# EAGLE design pandora_B_v1 (EAGLE 9.6.2)

## Sheet 1 of 4: Power
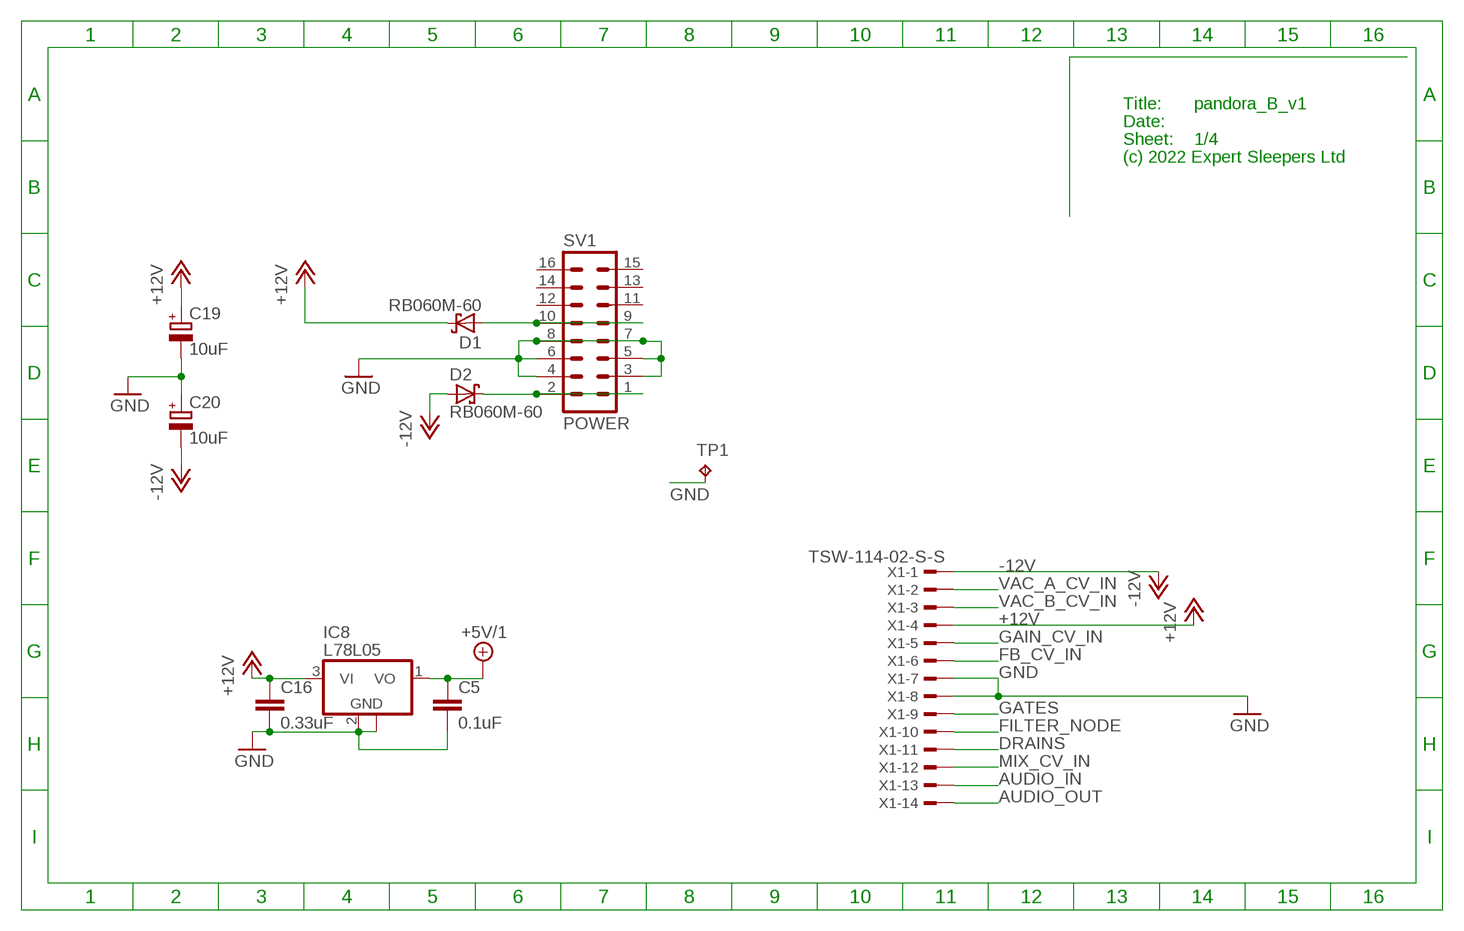
[diagram p0: schematic, sheet 1]

### Parts
C5  0.1uF  C-EUC0402  [C0402]
C16  0.33uF  C-EUC0805  [C0805]
C19  10uF  CPOL-EUUD-4X5,8  [UD-4X5,8_NICHICON]
C20  10uF  CPOL-EUUD-4X5,8  [UD-4X5,8_NICHICON]
D1  RB060M-60  [SOD123FL]
D2  RB060M-60  [SOD123FL]
IC8  L78L05  78L05F  [SOT89]
SV1  POWER  ML16  [ML16]
TP1  RA2  TPPAD1-13  [P1-13]
X1  TSW-114-02-S-S  [TSW-114-02-S-S]

### Nets
+5V/1: C5.1 IC8.1(VO) ; also sheet 2,3,4
+12V: C16.1 C19.+ D1.C IC8.3(VI) X1.4 ; also sheet 2,3,4
-12V: C20.- D2.A X1.1 ; also sheet 2,3,4
AUDIO_IN: X1.13 ; also sheet 2
AUDIO_OUT: X1.14 ; also sheet 2
DRAINS: X1.11 ; also sheet 3
FB_CV_IN: X1.6 ; also sheet 4
FILTER_NODE: X1.10 ; also sheet 3,4
GAIN_CV_IN: X1.5 ; also sheet 4
GATES: X1.9 ; also sheet 3
GND [power]: C5.2 C16.2 C19.- C20.+ IC8.2(GND) IC8.2@1(GND) SV1.3 SV1.4 SV1.5 SV1.6 SV1.7 SV1.8 TP1.TP X1.7 X1.8 ; also sheet 2,3,4
MIX_CV_IN: X1.12 ; also sheet 2
N$1: D2.C SV1.1 SV1.2
N$15: D1.A SV1.9 SV1.10
VAC_A_CV_IN: X1.2 ; also sheet 3
VAC_B_CV_IN: X1.3 ; also sheet 3
Unconnected: SV1.11 SV1.12 SV1.13 SV1.14 SV1.15 SV1.16

### Notes on the sheet
- Title:
- Date:
- Sheet:
- (c) 2022 Expert Sleepers Ltd

## Sheet 2 of 4: Mixer
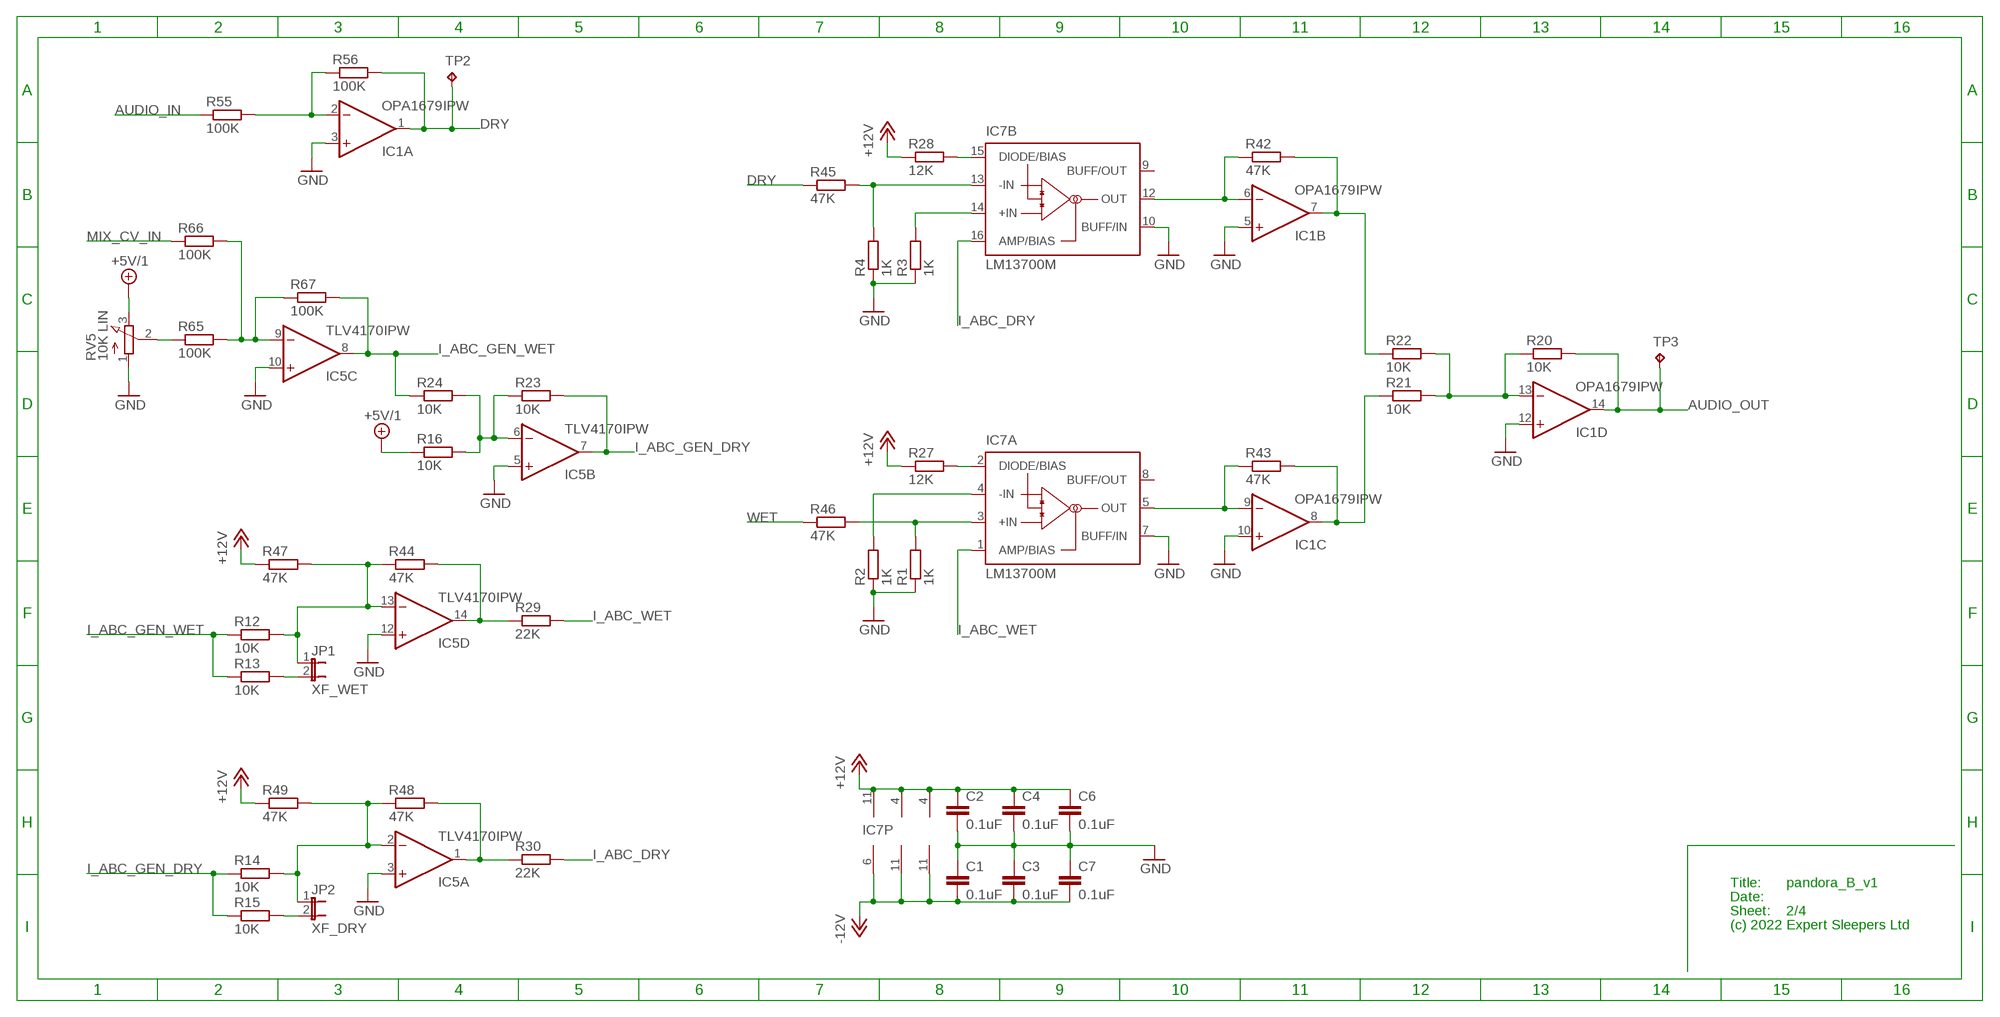
[diagram p1: schematic, sheet 2]

### Parts
C1  0.1uF  C-EUC0402  [C0402]
C2  0.1uF  C-EUC0402  [C0402]
C3  0.1uF  C-EUC0402  [C0402]
C4  0.1uF  C-EUC0402  [C0402]
C6  0.1uF  C-EUC0402  [C0402]
C7  0.1uF  C-EUC0402  [C0402]
IC1  OPA1679IPW  TL074PW  [PW_R-PDSO-G14]
IC5  TLV4170IPW  TL074PW  [PW_R-PDSO-G14]
IC7  LM13700M  [SO16]
JP1  XF_WET  JP1E  [JP1]
JP2  XF_DRY  JP1E  [JP1]
R1  1K  R-EU_R0603  [R0603]
R2  1K  R-EU_R0603  [R0603]
R3  1K  R-EU_R0603  [R0603]
R4  1K  R-EU_R0603  [R0603]
R12  10K  R-EU_R0603  [R0603]
R13  10K  R-EU_R0603  [R0603]
R14  10K  R-EU_R0603  [R0603]
R15  10K  R-EU_R0603  [R0603]
R16  10K  R-EU_R0603  [R0603]
R20  10K  R-EU_R0603  [R0603]
R21  10K  R-EU_R0603  [R0603]
R22  10K  R-EU_R0603  [R0603]
R23  10K  R-EU_R0603  [R0603]
R24  10K  R-EU_R0603  [R0603]
R27  12K  R-EU_R0603  [R0603]
R28  12K  R-EU_R0603  [R0603]
R29  22K  R-EU_R0603  [R0603]
R30  22K  R-EU_R0603  [R0603]
R42  47K  R-EU_R0603  [R0603]
R43  47K  R-EU_R0603  [R0603]
R44  47K  R-EU_R0603  [R0603]
R45  47K  R-EU_R0603  [R0603]
R46  47K  R-EU_R0603  [R0603]
R47  47K  R-EU_R0603  [R0603]
R48  47K  R-EU_R0603  [R0603]
R49  47K  R-EU_R0603  [R0603]
R55  100K  R-EU_R0603  [R0603]
R56  100K  R-EU_R0603  [R0603]
R65  100K  R-EU_R0603  [R0603]
R66  100K  R-EU_R0603  [R0603]
R67  100K  R-EU_R0603  [R0603]
RV5  10K LIN  RD1610NOA0X  [RD1610NOA0X]
TP2  RA2  TPPAD1-13  [P1-13]
TP3  RA2  TPPAD1-13  [P1-13]

### Nets
+5V/1: R16.1 RV5.3(E) ; also sheet 1,3,4
+12V: C2.1 C4.1 C6.1 IC1.4(P:V+) IC5.4(P:V+) IC7.11(P:V+) R27.1 R28.1 R47.1 R49.1 ; also sheet 1,3,4
-12V: C1.2 C3.2 C7.2 IC1.11(P:V-) IC5.11(P:V-) IC7.6(P:V-) ; also sheet 1,3,4
AUDIO_IN: R55.1 ; also sheet 1
AUDIO_OUT: IC1.14(D:OUT) R20.2 TP3.TP ; also sheet 1
DRY: IC1.1(A:OUT) R45.1 R56.2 TP2.TP ; also sheet 4
GND [power]: C1.1 C2.2 C3.1 C4.2 C6.2 C7.1 IC1.3(A:+IN) IC1.5(B:+IN) IC1.10(C:+IN) IC1.12(D:+IN) IC5.3(A:+IN) IC5.5(B:+IN) IC5.10(C:+IN) IC5.12(D:+IN) IC7.7(A:BUFF/IN) IC7.10(B:BUFF/IN) R1.1 R2.1 R3.1 R4.1 RV5.1(A) ; also sheet 1,3,4
I_ABC_DRY: IC7.16(B:AMP/BIAS) R30.2
I_ABC_GEN_DRY: IC5.7(B:OUT) R14.1 R15.1 R23.2
I_ABC_GEN_WET: IC5.8(C:OUT) R12.1 R13.1 R24.1 R67.2
I_ABC_WET: IC7.1(A:AMP/BIAS) R29.2
MIX_CV_IN: R66.1 ; also sheet 1
N$2: IC1.13(D:-IN) R20.1 R21.2 R22.2
N$7: R65.1 RV5.2(S)
N$9: IC7.15(B:DIODE/BIAS) R28.2
N$10: IC1.9(C:-IN) IC7.5(A:OUT) R43.1
N$12: IC7.2(A:DIODE/BIAS) R27.2
N$13: IC1.6(B:-IN) IC7.12(B:OUT) R42.1
N$14: IC1.8(C:OUT) R21.1 R43.2
N$18: IC5.9(C:-IN) R65.2 R66.2 R67.1
N$20: IC1.7(B:OUT) R22.1 R42.2
N$23: IC7.3(A:+IN) R1.2 R46.2
N$24: IC7.4(A:-IN) R2.2
N$26: IC5.13(D:-IN) JP1.1 R12.2 R44.1 R47.2
N$27: IC5.6(B:-IN) R16.2 R23.1 R24.2
N$28: IC5.14(D:OUT) R29.1 R44.2
N$31: IC5.1(A:OUT) R30.1 R48.2
N$32: IC5.2(A:-IN) JP2.1 R14.2 R48.1 R49.2
N$33: IC7.14(B:+IN) R3.2
N$34: IC7.13(B:-IN) R4.2 R45.2
N$44: IC1.2(A:-IN) R55.2 R56.1
N$68: JP2.2 R15.2
N$77: JP1.2 R13.2
WET: R46.1 ; also sheet 3,4
Unconnected: IC7.8(A:BUFF/OUT) IC7.9(B:BUFF/OUT)

### Notes on the sheet
- Title:
- Date:
- Sheet:
- (c) 2022 Expert Sleepers Ltd

## Sheet 3 of 4: Filter core
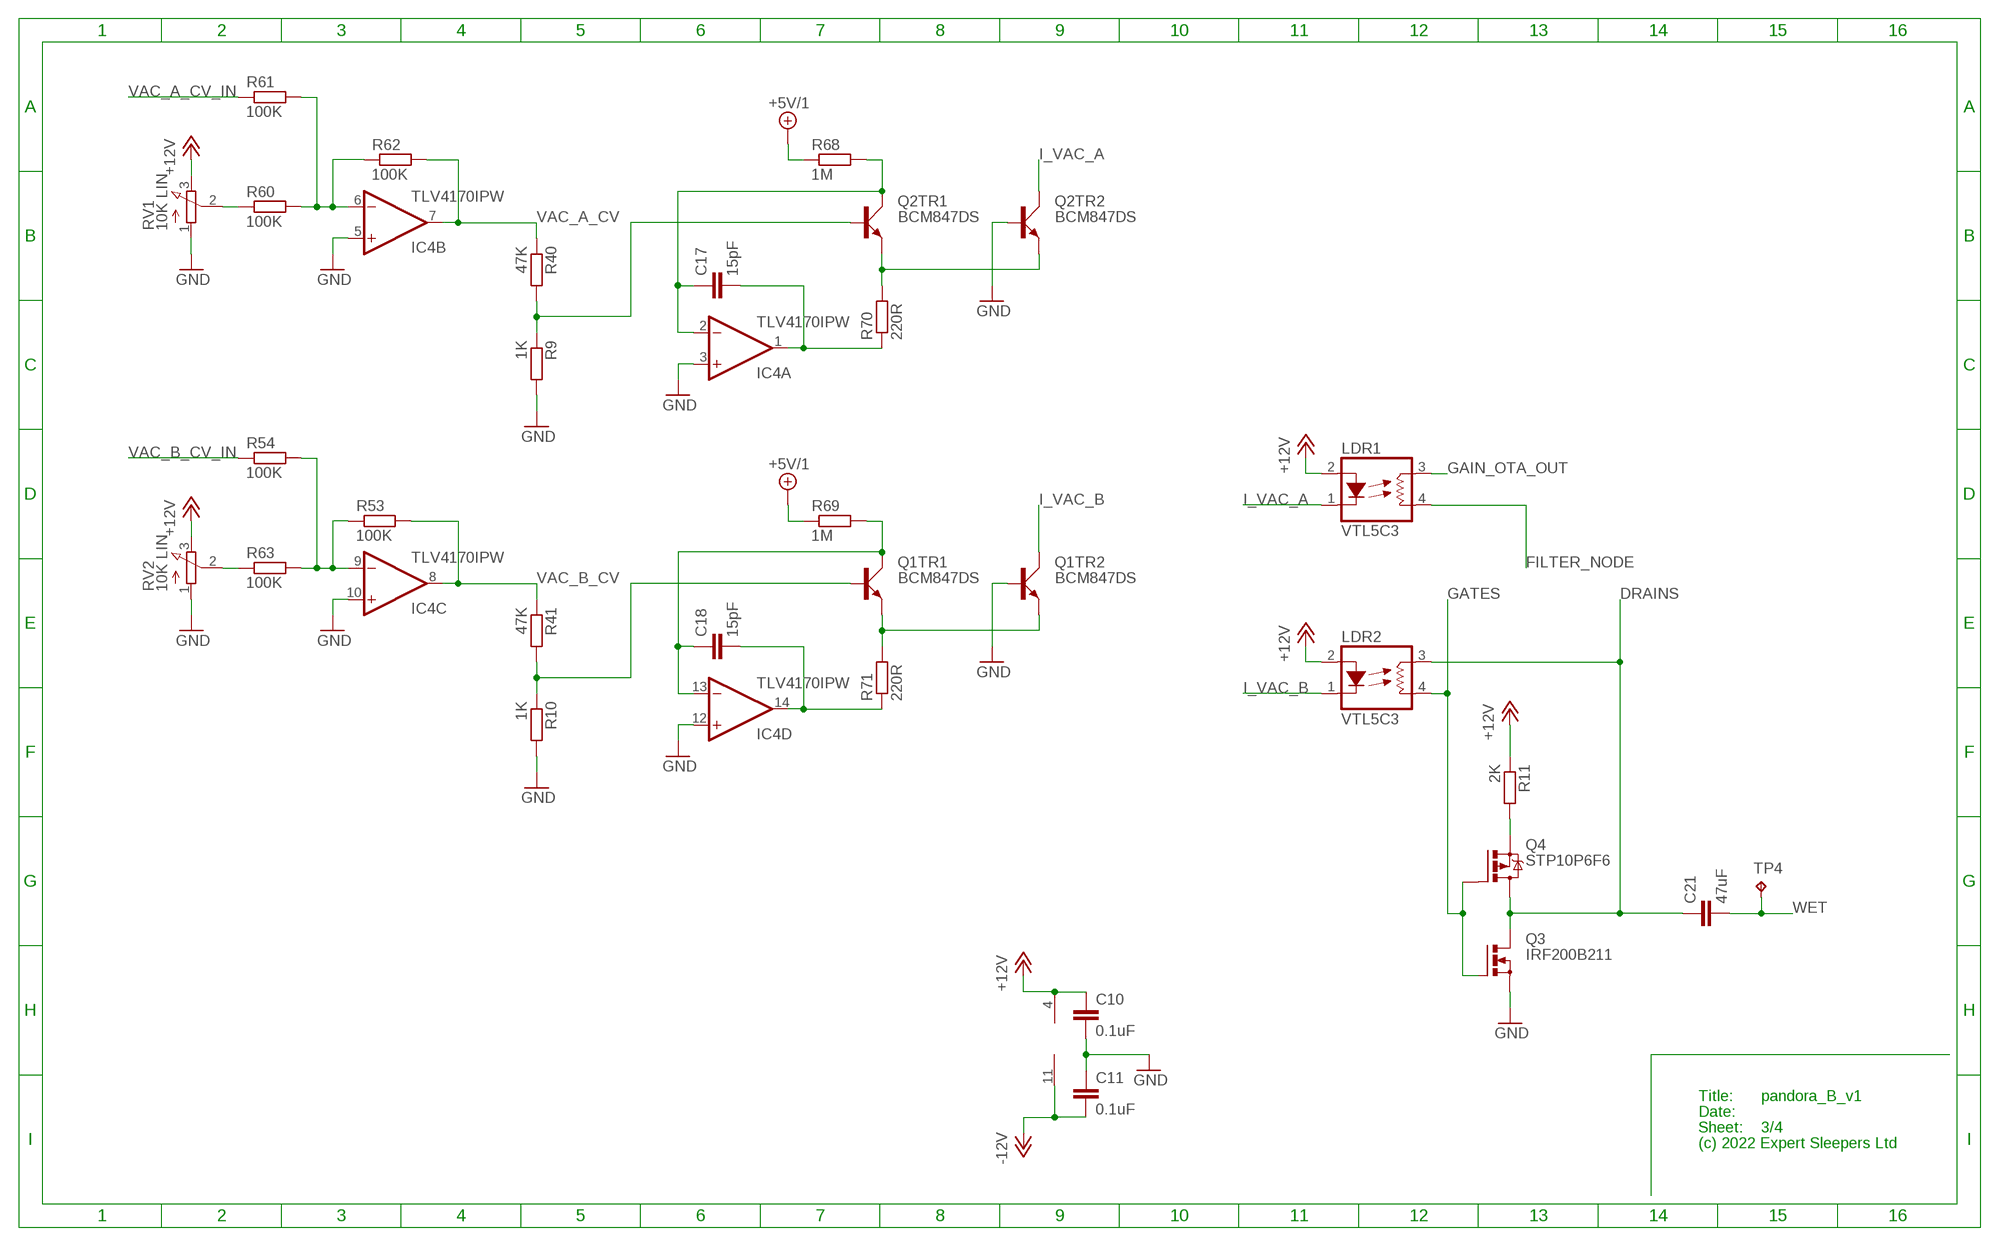
[diagram p2: schematic, sheet 3]

### Parts
C10  0.1uF  C-EUC0402  [C0402]
C11  0.1uF  C-EUC0402  [C0402]
C17  15pF  C-EUC0402  [C0402]
C18  15pF  C-EUC0402  [C0402]
C21  47uF  C-EUC1206  [C1206]
IC4  TLV4170IPW  TL074PW  [PW_R-PDSO-G14]
LDR1  VTL5C3  VTL5C9  [VTL5C]
LDR2  VTL5C3  VTL5C9  [VTL5C]
Q1  BCM847DS  [SOT95P275X110-6N]
Q2  BCM847DS  [SOT95P275X110-6N]
Q3  IRF200B211  IRF512  [TO220BV]
Q4  STP10P6F6  IRF9530  [TO220BV]
R9  1K  R-EU_R0603  [R0603]
R10  1K  R-EU_R0603  [R0603]
R11  2K  R-EU_R1206  [R1206]
R40  47K  R-EU_R0603  [R0603]
R41  47K  R-EU_R0603  [R0603]
R53  100K  R-EU_R0603  [R0603]
R54  100K  R-EU_R0603  [R0603]
R60  100K  R-EU_R0603  [R0603]
R61  100K  R-EU_R0603  [R0603]
R62  100K  R-EU_R0603  [R0603]
R63  100K  R-EU_R0603  [R0603]
R68  1M  R-EU_R0603  [R0603]
R69  1M  R-EU_R0603  [R0603]
R70  220R  R-EU_R0805  [R0805]
R71  220R  R-EU_R0805  [R0805]
RV1  10K LIN  RD1610NOA0X  [RD1610NOA0X]
RV2  10K LIN  RD1610NOA0X  [RD1610NOA0X]
TP4  RA2  TPPAD1-13  [P1-13]

### Nets
+5V/1: R68.1 R69.1 ; also sheet 1,2,4
+12V: C10.1 IC4.4(P:V+) LDR1.2(A) LDR2.2(A) R11.1 RV1.3(E) RV2.3(E) ; also sheet 1,2,4
-12V: C11.2 IC4.11(P:V-) ; also sheet 1,2,4
DRAINS: C21.1 LDR2.3(L1) Q3.D Q4.D ; also sheet 1
FILTER_NODE: LDR1.4(L2) ; also sheet 1,4
GAIN_OTA_OUT: LDR1.3(L1) ; also sheet 4
GATES: LDR2.4(L2) Q3.G Q4.G ; also sheet 1
GND [power]: C10.2 C11.1 IC4.3(A:+IN) IC4.5(B:+IN) IC4.10(C:+IN) IC4.12(D:+IN) Q1.5(TR2:B) Q2.5(TR2:B) Q3.S R9.2 R10.2 RV1.1(A) RV2.1(A) ; also sheet 1,2,4
I_VAC_A: LDR1.1(C) Q2.3(TR2:C)
I_VAC_B: LDR2.1(C) Q1.3(TR2:C)
N$49: R60.1 RV1.2(S)
N$56: IC4.6(B:-IN) R60.2 R61.2 R62.1
N$57: R63.1 RV2.2(S)
N$58: IC4.9(C:-IN) R53.1 R54.2 R63.2
N$59: Q2.2(TR1:B) R9.1 R40.2
N$60: C17.1 IC4.2(A:-IN) Q2.6(TR1:C) R68.2
N$61: C17.2 IC4.1(A:OUT) R70.1
N$64: Q2.1(TR1:E) Q2.4(TR2:E) R70.2
N$67: Q1.2(TR1:B) R10.1 R41.2
N$69: C18.1 IC4.13(D:-IN) Q1.6(TR1:C) R69.2
N$70: C18.2 IC4.14(D:OUT) R71.1
N$73: Q1.1(TR1:E) Q1.4(TR2:E) R71.2
N$75: Q4.S R11.2
VAC_A_CV: IC4.7(B:OUT) R40.1 R62.2
VAC_A_CV_IN: R61.1 ; also sheet 1
VAC_B_CV: IC4.8(C:OUT) R41.1 R53.2
VAC_B_CV_IN: R54.1 ; also sheet 1
WET: C21.2 TP4.TP ; also sheet 2,4

### Notes on the sheet
- Title:
- Date:
- Sheet:
- (c) 2022 Expert Sleepers Ltd

## Sheet 4 of 4: Gain and Feedback
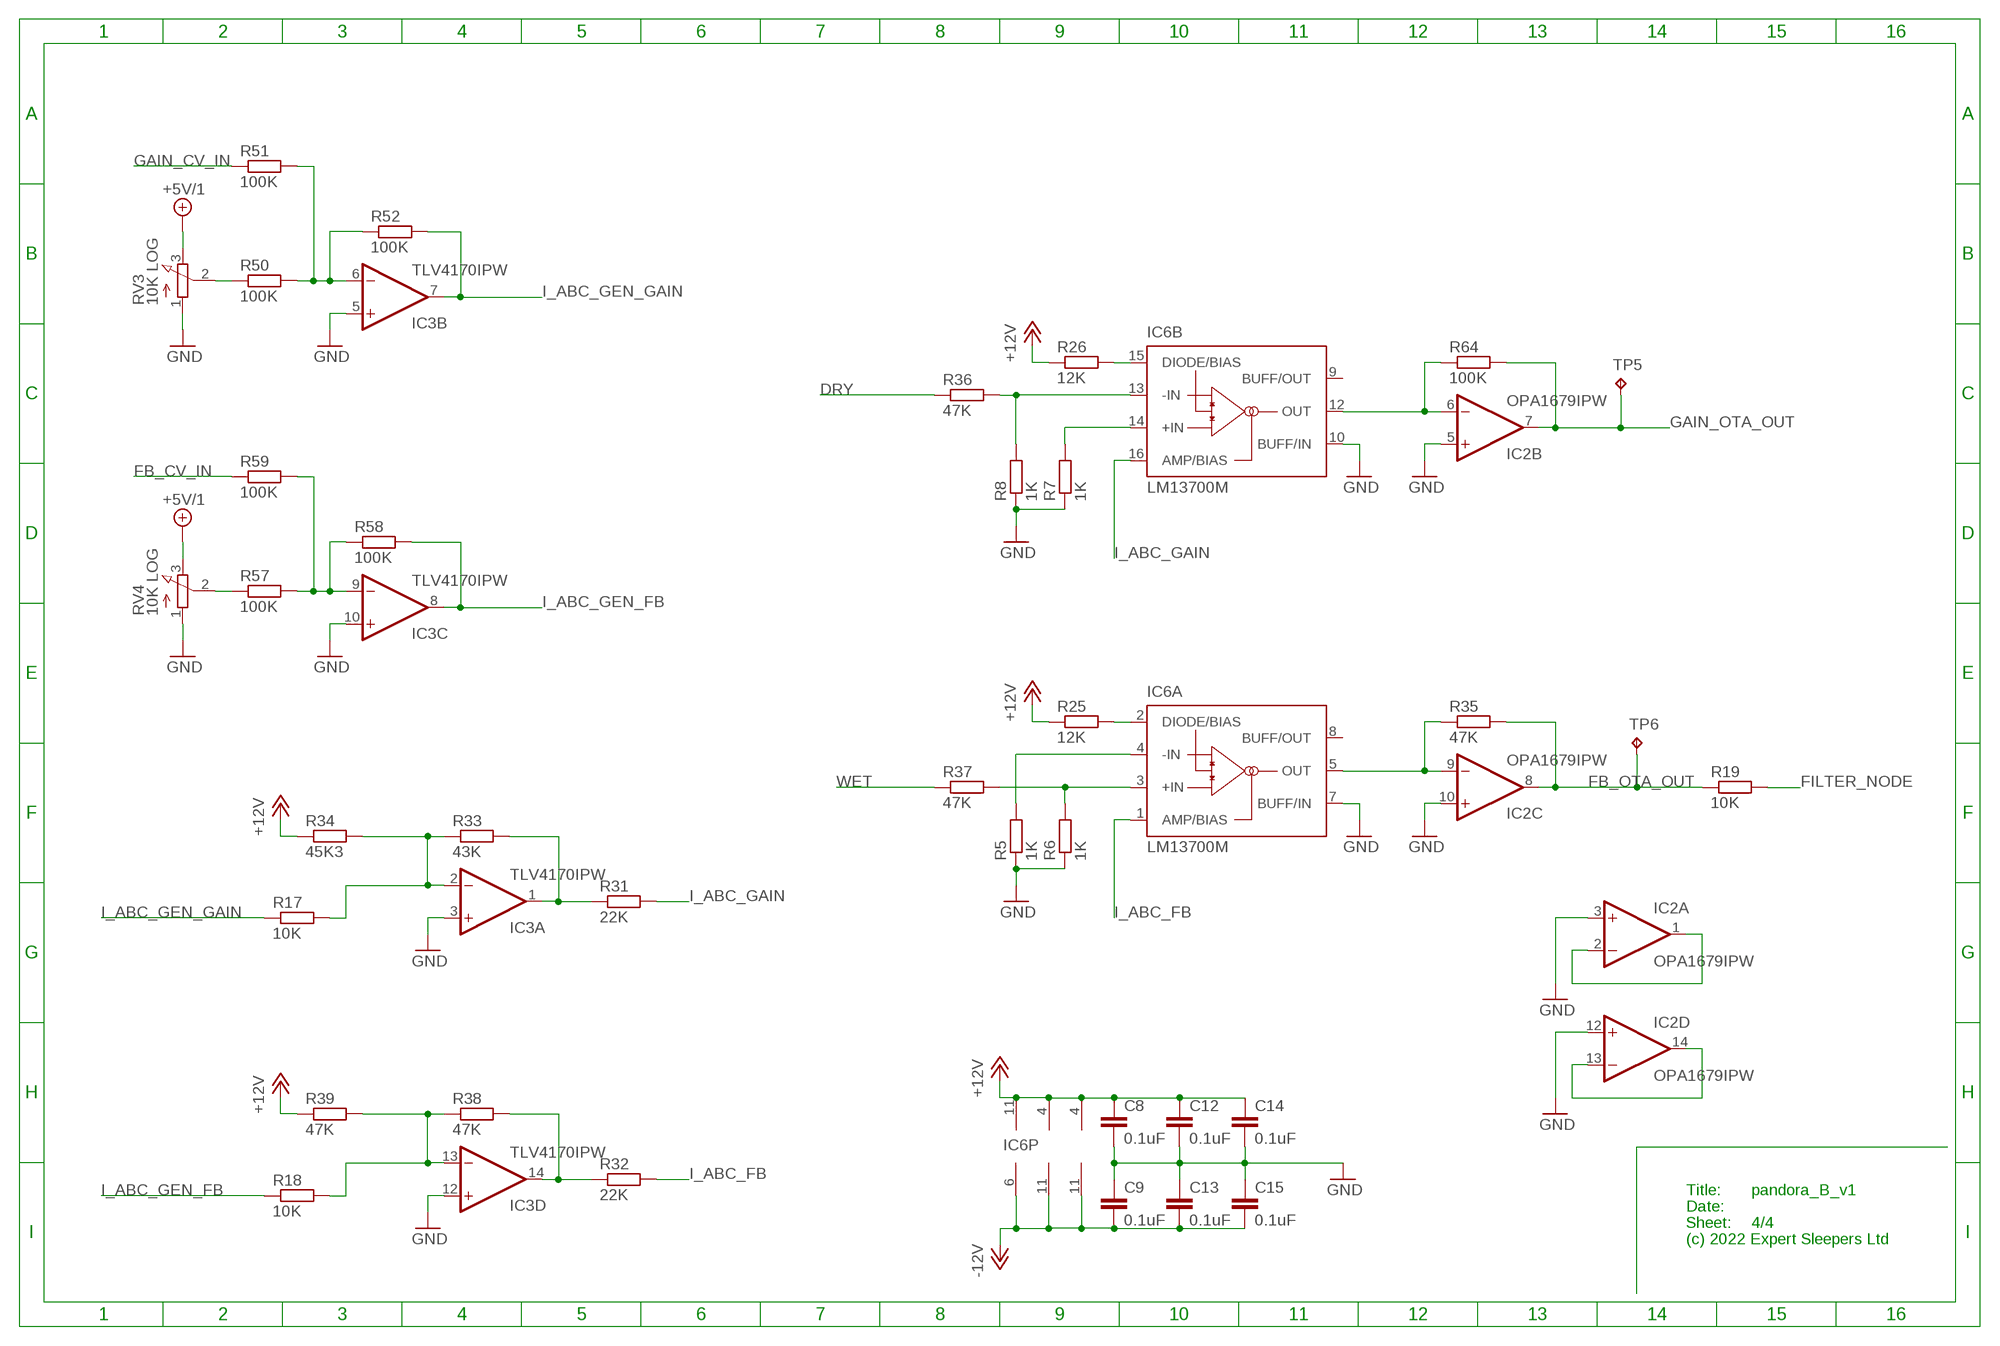
[diagram p3: schematic, sheet 4]

### Parts
C8  0.1uF  C-EUC0402  [C0402]
C9  0.1uF  C-EUC0402  [C0402]
C12  0.1uF  C-EUC0402  [C0402]
C13  0.1uF  C-EUC0402  [C0402]
C14  0.1uF  C-EUC0402  [C0402]
C15  0.1uF  C-EUC0402  [C0402]
IC2  OPA1679IPW  TL074PW  [PW_R-PDSO-G14]
IC3  TLV4170IPW  TL074PW  [PW_R-PDSO-G14]
IC6  LM13700M  [SO16]
R5  1K  R-EU_R0603  [R0603]
R6  1K  R-EU_R0603  [R0603]
R7  1K  R-EU_R0603  [R0603]
R8  1K  R-EU_R0603  [R0603]
R17  10K  R-EU_R0603  [R0603]
R18  10K  R-EU_R0603  [R0603]
R19  10K  R-EU_R0603  [R0603]
R25  12K  R-EU_R0603  [R0603]
R26  12K  R-EU_R0603  [R0603]
R31  22K  R-EU_R0603  [R0603]
R32  22K  R-EU_R0603  [R0603]
R33  43K  R-EU_R0603  [R0603]
R34  45K3  R-EU_R0603  [R0603]
R35  47K  R-EU_R0603  [R0603]
R36  47K  R-EU_R0603  [R0603]
R37  47K  R-EU_R0603  [R0603]
R38  47K  R-EU_R0603  [R0603]
R39  47K  R-EU_R0603  [R0603]
R50  100K  R-EU_R0603  [R0603]
R51  100K  R-EU_R0603  [R0603]
R52  100K  R-EU_R0603  [R0603]
R57  100K  R-EU_R0603  [R0603]
R58  100K  R-EU_R0603  [R0603]
R59  100K  R-EU_R0603  [R0603]
R64  100K  R-EU_R0603  [R0603]
RV3  10K LOG  RD1610NOA0X  [RD1610NOA0X]
RV4  10K LOG  RD1610NOA0X  [RD1610NOA0X]
TP5  RA2  TPPAD1-13  [P1-13]
TP6  RA2  TPPAD1-13  [P1-13]

### Nets
+5V/1: RV3.3(E) RV4.3(E) ; also sheet 1,2,3
+12V: C8.1 C12.1 C14.1 IC2.4(P:V+) IC3.4(P:V+) IC6.11(P:V+) R25.1 R26.1 R34.1 R39.1 ; also sheet 1,2,3
-12V: C9.2 C13.2 C15.2 IC2.11(P:V-) IC3.11(P:V-) IC6.6(P:V-) ; also sheet 1,2,3
DRY: R36.1 ; also sheet 2
FB_CV_IN: R59.1 ; also sheet 1
FB_OTA_OUT: IC2.8(C:OUT) R19.1 R35.2 TP6.TP
FILTER_NODE: R19.2 ; also sheet 1,3
GAIN_CV_IN: R51.1 ; also sheet 1
GAIN_OTA_OUT: IC2.7(B:OUT) R64.2 TP5.TP ; also sheet 3
GND [power]: C8.2 C9.1 C12.2 C13.1 C14.2 C15.1 IC2.3(A:+IN) IC2.5(B:+IN) IC2.10(C:+IN) IC2.12(D:+IN) IC3.3(A:+IN) IC3.5(B:+IN) IC3.10(C:+IN) IC3.12(D:+IN) IC6.7(A:BUFF/IN) IC6.10(B:BUFF/IN) R5.1 R6.1 R7.1 R8.1 RV3.1(A) RV4.1(A) ; also sheet 1,2,3
I_ABC_FB: IC6.1(A:AMP/BIAS) R32.2
I_ABC_GAIN: IC6.16(B:AMP/BIAS) R31.2
I_ABC_GEN_FB: IC3.8(C:OUT) R18.1 R58.2
I_ABC_GEN_GAIN: IC3.7(B:OUT) R17.1 R52.2
N$35: R57.1 RV4.2(S)
N$36: IC3.9(C:-IN) R57.2 R58.1 R59.2
N$37: IC6.15(B:DIODE/BIAS) R26.2
N$38: IC6.2(A:DIODE/BIAS) R25.2
N$39: IC2.9(C:-IN) IC6.5(A:OUT) R35.1
N$40: IC2.6(B:-IN) IC6.12(B:OUT) R64.1
N$41: IC2.1(A:OUT) IC2.2(A:-IN)
N$42: IC2.13(D:-IN) IC2.14(D:OUT)
N$43: IC6.3(A:+IN) R6.2 R37.2
N$45: IC6.4(A:-IN) R5.2
N$46: IC6.14(B:+IN) R7.2
N$48: IC6.13(B:-IN) R8.2 R36.2
N$50: R50.1 RV3.2(S)
N$51: IC3.6(B:-IN) R50.2 R51.2 R52.1
N$52: IC3.2(A:-IN) R17.2 R33.1 R34.2
N$53: IC3.1(A:OUT) R31.1 R33.2
N$54: IC3.14(D:OUT) R32.1 R38.2
N$55: IC3.13(D:-IN) R18.2 R38.1 R39.2
WET: R37.1 ; also sheet 2,3
Unconnected: IC6.8(A:BUFF/OUT) IC6.9(B:BUFF/OUT)

### Notes on the sheet
- Title:
- Date:
- Sheet:
- (c) 2022 Expert Sleepers Ltd

## Library data of the parts
C1-C18 C21 = rcl:C-EU: CAPACITOR, European symbol
C19 C20 = rcl:CPOL-EU: POLARIZED CAPACITOR, European symbol
D1 D2 = rohm2:RB060M-60: Schottky Barrier Diode
IC1-IC5 = digital-audio:TL074: OP AMP
IC6 IC7 = texas:LM13700: Dual Operational Transconductance Amplifiers with Linearizing Diodes and Buffers Source: lm13700.PDF
IC8 = linear:78L*: POSITOIV-VOLTAGE REGULATORS Output up to 100 mA Source: http://focus.ti.com/lit/ds/symlink/ua78l05.pdf
JP1 JP2 = jumper:JP1E: JUMPER
LDR1 LDR2 = optocoupler:VTL5C*: Low Cost Axial Vactrols Source: www.perkinelmer.com/opto ... vtl5c9_c10.pdf; MF: VACTEC PHOTO; MPN: VTL5C9; OC_FARNELL: 2067857; OC_NEWARK: 95F9033
Q1 Q2 = SamacSys_Parts:BCM847DS: Bipolar Transistors - BJT TRANS MATCHED PAIR Source: Datasheet <https://assets.nexperia.com/documents/data-sheet/BCM847BV_BS_DS.pdf>; ARROW_PART_NUMBER: BCM847DS,135; ARROW_PRICE-STOCK: https://www.arrow.com/en/products/bcm847ds135/nexperia; DESCRIPTION: Bipolar Transistors - BJT TRANS MATCHED PAIR; HEIGHT: 1.1mm; MANUFACTURER_NAME: Nexperia; MANUFACTURER_PART_NUMBER: BCM847DS,135; MOUSER_PART_NUMBER: 771-BCM847DS135; MOUSER_PRICE-STOCK: https://www.mouser.co.uk/ProductDetail/Nexperia/BCM847DS135?qs=me8TqzrmIYUAGZzjtP%252B2bg%3D%3D
Q3 = transistor-power:IRF512: N-CHANNEL MOS FET
Q4 = transistor-power:IRF9530: P-CHANNEL HEXFET POWER-MOS-FET Source: http://www.irf.com/product-info/datasheets/data/irf9530.pdf
R1-R71 = rcl:R-EU_: RESISTOR, European symbol
RV1-RV5 = soundwell:RD1610NOA0X: 16mm Potentiometer one level Source: http://www.alphapotentiometers.net/html/16mm_pot_2.html
SV1 = digital-audio:ML16: MULTICOMP - MC9A12-1634
TP1-TP6 = testpad:TP: Test pad
X1 = con-samtec:TSW-114-02-S-S: THROUGH-HOLE .025" SQ POST HEADER Source: Samtec TSW.pdf; OC_FARNELL: unknown; OC_NEWARK: unknown

## Board
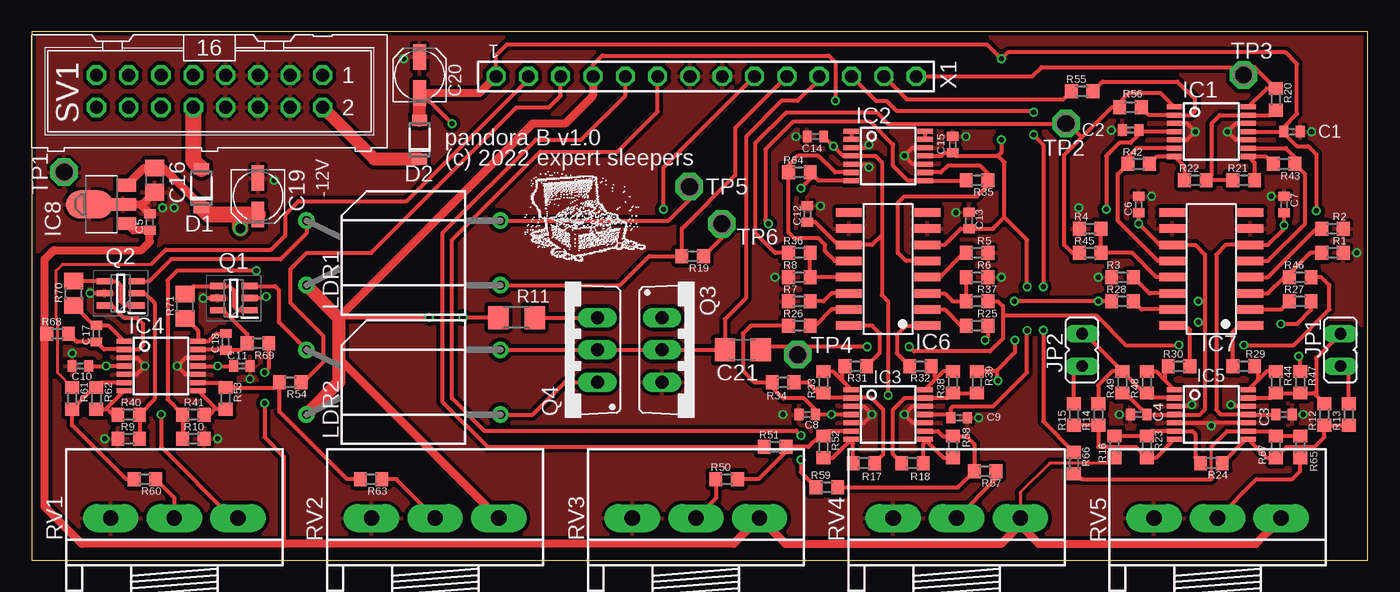
[diagram p4: board, top side]
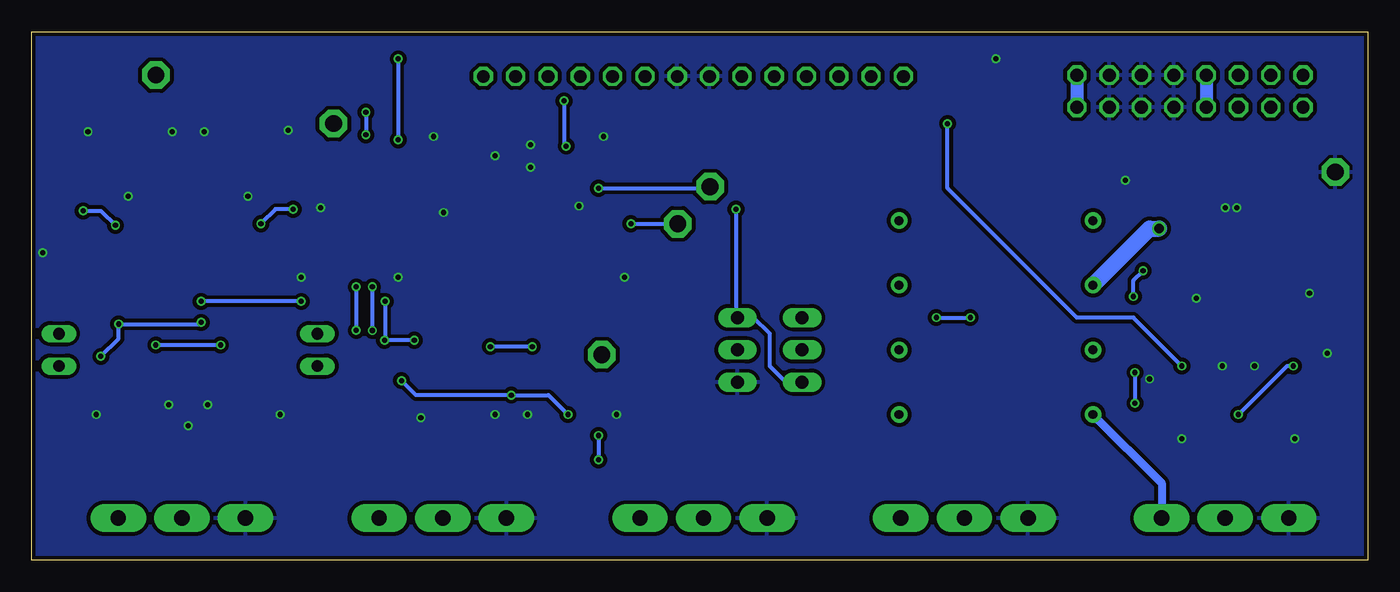
[diagram p5: board, bottom side, seen from below]

Size 105 x 41.5 mm. Coordinates in mm from the lower left corner, seen from the top.
Outline: 0,0 105,0 105,41.5 0,41.5 0,0
Copper layers (1*16): Top 0.035mm / dielectric 1.5mm / Bottom 0.035mm
Design rules "pcbtrain *": minimum track width 0.125mm, minimum drill 0.3mm, track to track 0.125mm, track to pad 0.125mm, pad to pad 0.125mm, via to via 0.125mm, smd to smd 0.125mm, copper to edge 0.25mm, drill to drill 8mil, minimum pad ring 0.15mm, minimum via ring 0.15mm, stop-mask expansion 4mil, vias tented up to drill 0mil, thermal gap 10mil

### Footprints (pad centres in the part's own frame; a part is rotated, then mirrored left to right if it is on the bottom)
C0402 = smd 0.7 x 0.9: 1 -0.65,0; 2 0.65,0
C0805 = smd 1.3 x 1.5: 1 -0.95,0; 2 0.95,0
UD-4X5,8_NICHICON = smd 2 x 1: + 1.425,0; - -1.425,0
C1206 = smd 1.6 x 1.8: 1 -1.4,0; 2 1.4,0
SOD123FL = smd 0.85 x 1.2: A 1.525,0; C -1.525,0
PW_R-PDSO-G14 = smd 0.4 x 1.2: 1 -1.95,-2.9; 2 -1.3,-2.9; 3 -0.65,-2.9; 4 0,-2.9; 5 0.65,-2.9; 6 1.3,-2.9; 7 1.95,-2.9; 8 1.95,2.9; 9 1.3,2.9; 10 0.65,2.9; 11 0,2.9; 12 -0.65,2.9; 13 -1.3,2.9; 14 -1.95,2.9
SO16 = smd 0.66 x 2.032: 1 -4.445,-3.073; 2 -3.175,-3.073; 3 -1.905,-3.073; 4 -0.635,-3.073; 5 0.635,-3.073; 6 1.905,-3.073; 7 3.175,-3.073; 8 4.445,-3.073; 9 4.445,3.073; 10 3.175,3.073; 11 1.905,3.073; 12 0.635,3.073; 13 -0.635,3.073; 14 -1.905,3.073; 15 -3.175,3.073; 16 -4.445,3.073
SOT89 = smd 1 x 1.5: 1 -1.499,-1.981; 3 1.499,-1.981 | smd 1 x 2: 2 0,-1.727 | smd 2.2 x 3.7: 2@1 0,0.94
JP1 = drill 0.914 long: 1 0,-1.27; 2 0,1.27
VTL5C = drill 0.7 pad 1.3: 1 -7.62,2.54; 2 -7.62,-2.54; 3 7.62,2.54; 4 7.62,-2.54
SOT95P275X110-6N = smd 1.25 x 0.5: 1 -1.25,0.95; 2 -1.25,0; 3 -1.25,-0.95; 4 1.25,-0.95; 5 1.25,0; 6 1.25,0.95
TO220BV = drill 1.016 long: D 0,-2.54; G -2.54,-2.54; S 2.54,-2.54
R0603 = smd 1 x 1.1: 1 -0.85,0; 2 0.85,0
R1206 = smd 1.6 x 1.803: 1 -1.422,0; 2 1.422,0
R0805 = smd 1.3 x 1.5: 1 -0.95,0; 2 0.95,0
RD1610NOA0X = drill 1.2 pad 2.184 long: 1 -5,3.8; 2 0,3.8; 3 5,3.8
ML16 = drill 1.016 octagon: 1 -8.89,-1.27; 2 -8.89,1.27; 3 -6.35,-1.27; 4 -6.35,1.27; 5 -3.81,-1.27; 6 -3.81,1.27; 7 -1.27,-1.27; 8 -1.27,1.27; 9 1.27,-1.27; 10 1.27,1.27; 11 3.81,-1.27; 12 3.81,1.27; 13 6.35,-1.27; 14 6.35,1.27; 15 8.89,-1.27; 16 8.89,1.27
P1-13 = drill 1.321 pad 2.159 octagon: TP 0,0
TSW-114-02-S-S = drill 1 pad 1.5 octagon: 1 16.51,0; 2 13.97,0; 3 11.43,0; 4 8.89,0; 5 6.35,0; 6 3.81,0; 7 1.27,0; 8 -1.27,0; 9 -3.81,0; 10 -6.35,0; 11 -8.89,0; 12 -11.43,0; 13 -13.97,0; 14 -16.51,0

### Placement (x,y rotation side)
C1  99.06,33.66 180 top
C2  86.36,33.78 180 top
C3  98.42,11.43 180 top
C4  87,11.43 180 top
C5  9.27,26.54 90 top
C6  87,27.94 90 top
C7  98.42,27.94 270 top
C8  60.96,11.43 180 top
C9  72.9,11.18 180 top
C10  3.81,15.24 180 top
C11  16.51,15.24 180 top
C12  60.96,27.18 90 top
C13  73.66,26.67 270 top
C14  61.59,33.27 180 top
C15  72.39,32.64 270 top
C16  9.65,29.84 270 top
C17  5.08,17.78 90 top
C18  15.24,17.14 90 top
C19  17.78,28.57 270 top
C20  30.48,38.1 90 top
C21  55.88,16.51 0 top
D1  13.34,29.21 90 top
D2  30.48,33.02 90 top
IC1  92.71,33.66 270 top
IC2  67.31,31.75 270 top
IC3  67.31,11.43 270 top
IC4  10.16,15.24 270 top
IC5  92.71,11.43 270 top
IC6  67.31,22.86 90 top
IC7  92.71,22.86 90 top
IC8  5.46,27.94 90 top
JP1  102.87,16.51 180 top
JP2  82.55,16.51 180 top
LDR1  29.21,24.13 0 top
LDR2  29.21,13.97 0 top
Q1  15.88,20.57 180 top
Q2  6.99,20.95 180 top
Q3  52.07,16.51 270 top
Q4  41.91,16.51 90 top
R1  102.23,24.13 180 top
R2  102.23,26.04 180 top
R3  85.72,22.23 0 top
R4  83.19,26.04 0 top
R5  74.3,24.13 180 top
R6  74.3,22.23 180 top
R7  60.33,20.32 0 top
R8  60.33,22.23 0 top
R9  7.62,9.53 180 top
R10  12.7,9.53 0 top
R11  38.1,19.05 0 top
R12  101.6,11.43 90 top
R13  103.5,11.43 90 top
R14  83.82,11.43 90 top
R15  81.92,11.43 90 top
R16  85.09,8.89 90 top
R17  65.41,7.62 0 top
R18  69.22,7.62 180 top
R19  51.94,23.88 180 top
R20  97.79,36.2 90 top
R21  95.25,29.84 180 top
R22  91.44,29.84 0 top
R23  87.63,8.89 270 top
R24  92.71,7.62 180 top
R25  74.3,18.41 180 top
R26  60.33,18.41 0 top
R27  99.69,20.32 180 top
R28  85.72,20.32 0 top
R29  95.25,15.24 180 top
R30  90.17,15.24 0 top
R31  64.77,15.24 0 top
R32  69.85,15.24 180 top
R33  62.23,13.97 90 top
R34  59.05,13.97 0 top
R35  74.3,29.84 180 top
R36  60.33,24.13 0 top
R37  74.3,20.32 180 top
R38  72.39,13.97 90 top
R39  74.3,13.97 270 top
R40  7.62,11.43 0 top
R41  12.7,11.43 180 top
R42  87,31.11 0 top
R43  98.42,31.11 180 top
R44  97.79,13.97 90 top
R45  83.19,24.13 0 top
R46  99.69,22.23 180 top
R47  99.69,13.97 270 top
R48  87.63,13.97 90 top
R49  85.72,13.97 90 top
R50  54.61,6.35 0 top
R51  58.42,8.89 0 top
R52  62.23,8.89 270 top
R53  15.24,12.7 270 top
R54  20.32,13.97 180 top
R55  82.55,36.83 0 top
R56  86.36,35.56 180 top
R57  74.93,6.99 180 top
R58  72.39,8.89 270 top
R59  62.48,5.71 0 top
R60  8.89,6.35 180 top
R61  3.17,12.7 270 top
R62  5.08,12.7 270 top
R63  26.67,6.35 180 top
R64  60.33,30.48 0 top
R65  99.69,8.89 90 top
R66  81.92,7.62 270 top
R67  97.79,8.89 270 top
R68  2.03,17.78 0 top
R69  17.78,17.02 180 top
R70  3.3,20.95 90 top
R71  12.06,19.94 90 top
RV1  11.2,-0.5 0 top
RV2  31.7,-0.5 0 top
RV3  52.2,-0.5 0 top
RV4  72.7,-0.5 0 top
RV5  93.2,-0.5 0 top
SV1  13.97,36.83 180 top
TP1  2.54,30.48 90 top
TP2  81.28,34.29 0 top
TP3  95.25,38.1 0 top
TP4  60.2,16.13 0 top
TP5  51.69,29.34 0 top
TP6  54.23,26.42 0 top
U$2  [TREASURE_10MM_300DPI]  38.37,23.39 0 top
X1  53,38 180 top

### Tracks (layer width: path | path; a pad name or v marks a point on that pad's centre or on a via)
+5V/1  (via drill 0.4)
  Top 0.254: R16.1 84.67,7.62 80.01,7.62 77.7,5.31 RV4.3
  Top 0.305: R69.1 18.63,15.07 v18.29,14.73 | v18.29,12.32 18.29,9.65 19.81,8.13 19.81,1.27 | R68.1 1.02,17.78
  Top 0.61: IC8.1 7.99,25.89 C5.1 9.27,25.02 8.6,24.34 1.74,24.34 1.02,23.62 1.02,17.78 1.02,4.19 3.94,1.27 19.81,1.27 55.17,1.27 RV3.3 59.23,1.27 76.2,1.27 77.7,2.77 RV4.3 77.7,2.72 79.15,1.27 96.22,1.27 98.2,3.25 RV5.3
  Bottom 0.305: v18.29,14.73 v18.29,12.32
+12V  (via drill 0.4, 0.75)
  Top 0.305: IC4.4 v5.84,15.24 C10.1 | IC1.4 87.14,33.66 C2.1 87.01,33.42 86.36,32.77 85.47,32.77 84.45,31.75 v84.45,27.56 | IC3.4 v62.87,11.43 61.72,11.43 | 61.72,11.43 C8.1 | C14.1 v63,32.52 63.77,31.75 IC2.4 66.29,31.75 66.8,31.24 66.8,25.53 | R49.1 85.95,13.12 C4.1 IC5.4 91.82,11.43 92.2,11.81 92.2,18.67 | R11.1 v33.91,19.05 | v31.24,19.05 24.13,19.05 | v10.16,11.43 10.16,8.89 15.75,3.3 RV1.3 | 61.72,11.43 61.72,11.68 60.71,12.7 59.05,12.7 58.2,13.55 R34.1 56.77,13.97 55.88,14.86 55.88,17.78 56.52,18.41 R26.1 | 92.2,20.32 92.2,24 91.44,24.77 IC7.11 88.65,24.77 v87,26.42 C6.1 | 92.2,20.32 92.2,18.67 | C12.1 61.61,26.53 63.37,24.77 IC6.11 66.04,24.77 66.8,25.53 | 66.8,25.53 66.8,20.83 67.31,20.32 v67.31,12.95 | X1.4 44.11,38.9 44.83,39.62 62.65,39.62 63.16,39.12 v63.16,36.07 | R28.1 v83.82,20.32 v77.22,20.32 | v91.69,20.32 92.2,20.32 | v77.28,17.27 77.28,16.32 75.88,14.92 | R39.1 75.78,14.82 75.88,14.92 | R25.1 75.14,17.49 v74.93,17.27 | v75.95,14.1 75.88,14.16 75.88,14.92 | R27.1 100.55,19.65 99.44,18.54 v98.17,18.54 | v91.69,18.67 92.2,18.67 | R47.1 99.69,15.88 v99.57,16
  Top 0.61: IC8.3 8.8,30.8 C16.1 10.35,30.8 13.34,27.81 D1.C | RV2.3 24.13,15.87 | X1.4 44.11,36.49 41.91,34.29 39.37,34.29 24.13,19.05
  Top 1.016: LDR1.2 24.13,19.05 24.13,15.87 24.13,13.97 LDR2.2
  Top 1.27: D1.C 13.87,27.15 16.51,27.15 | 16.51,27.15 C19.+ | v16.38,26.04 16.38,27.02 16.51,27.15
  Bottom 0.305: v33.91,19.05 v31.24,19.05 | v10.16,11.43 6.35,15.24 v5.84,15.24 | v84.45,27.56 85.85,27.56 v87,26.42 | v62.87,11.43 64.39,12.95 v67.31,12.95 74.8,12.95 v75.95,14.1 | v63.16,36.07 63.16,32.68 v63,32.52 | v83.82,20.32 v91.69,20.32 | v77.22,20.32 77.22,17.34 v77.28,17.27 v74.93,17.27 | v91.69,18.67 91.82,18.54 v98.17,18.54 98.17,17.4 v99.57,16
  Bottom 0.61: LDR2.2 16.2,6.04 RV1.3
  Bottom 1.27: LDR1.2 17.14,26.04 v16.38,26.04
-12V  (via drill 0.4)
  Top 0.305: C11.2 v14.61,15.24 IC4.11 | C3.2 IC5.11 93.47,11.43 93.09,11.81 93.09,24 93.85,24.77 IC7.6 97.16,24.77 98.42,26.04 v98.42,26.29 C7.2 | IC1.11 C1.2 | IC3.11 71.99,11.43 C9.2 72.25,11.92 72.39,12.06 75.56,12.06 78.23,14.73 v78.23,18.03 | v33.02,34.29 30.64,36.67 C20.- | IC6.6 71.75,24.77 73.03,26.04 73.64,26.04 C13.2 75.55,26.02 76.45,26.92 | IC2.11 71.5,31.75 71.74,31.99 C15.2 72.63,31.75 75.95,31.75 | 75.95,31.75 76.45,31.24 76.45,26.92 | 76.45,26.92 78.23,25.15 v78.23,21.46 | C1.2 98.41,33.54 99.44,32.51 100.33,32.51 100.97,31.88 v100.97,27.43 | C1.2 98.41,34.02 99.44,35.05 99.44,38.99 98.55,39.88 76.71,39.88 v76.2,39.37 75.06,40.51 37.34,40.51 36.49,39.66 X1.1 | v76.2,33.02 76.2,32 75.95,31.75
  Top 0.61: X1.1 35.16,36.67 C20.-
  Top 1.016: D2.A C20.-
  Bottom 0.305: v14.61,15.24 18.41,19.05 22.86,19.05 33.02,29.21 v33.02,34.29 | v78.23,18.03 v78.23,21.46 | v100.97,27.43 99.57,27.43 v98.42,26.29 | v76.2,39.37 v76.2,33.02
AUDIO_IN
  Top 0.305: X1.13 68.78,36.2 81.06,36.2 R55.1
AUDIO_OUT
  Top 0.305: IC1.14 97.05,37.05 R20.2 96.1,38.73 95.25,38.73 | X1.14 78.64,38 79.38,38.73 95.25,38.73 | TP3.TP 95.25,38.73
DRAINS
  Top 0.305: LDR2.3 Q4.D Q3.D C21.1 54.48,18.92 56.13,20.57 56.13,33.27 58.93,36.07 60.2,36.07 61.89,37.76 X1.11
DRY
  Top 0.305: IC1.1 88.71,36.7 86.23,36.7 85.51,35.98 R56.2 84.88,35.56 82.55,33.23 | 82.55,33.23 81.15,31.84 81.15,24.77 81.79,24.13 R45.1 | 82.55,33.23 81.5,34.29 TP2.TP 67.31,34.29 66.42,35.18 59.31,35.18 56.9,32.77 56.9,25.65 58.42,24.13 R36.1
FB_CV_IN  (via drill 0.4)
  Top 0.305: v60.45,9.78 60.07,10.16 35.56,10.16 33.02,12.7 33.02,25.15 39.96,32.08 46.05,32.08 49.19,35.22 X1.6 | v60.45,7.87 60.45,6.9 R59.1
  Bottom 0.305: v60.45,9.78 v60.45,7.87
FB_OTA_OUT  (via drill 0.4)
  Top 0.305: R35.2 73.4,29.8 IC2.8 68.88,29.8 67.69,30.99 67.69,32.64 65.91,34.42 59.82,34.42 57.66,32.26 57.66,26.67 v57.91,26.42 | TP6.TP 54.23,25.31 R19.1
  Bottom 0.305: v57.91,26.42 TP6.TP
FILTER_NODE
  Top 0.305: LDR1.4 46.23,21.59 48.51,23.88 R19.2 51.09,26.04 55.28,30.23 55.28,33.93 X1.10
GAIN_CV_IN
  Top 0.305: R51.1 35.81,8.89 32.26,12.45 32.26,25.65 39.62,33.02 43.18,33.02 46.65,36.49 X1.5
GAIN_OTA_OUT  (via drill 0.4)
  Top 0.305: LDR1.3 50.04,26.67 51.69,28.32 TP5.TP | IC2.7 61.85,29.8 R64.2 61.17,29.93 v60.45,29.21
  Bottom 0.305: TP5.TP 51.82,29.21 v60.45,29.21
GATES  (via drill 0.4)
  Top 0.305: LDR2.4 39.37,11.43 41.91,13.97 Q4.G | X1.9 49.66,30.85 v49.66,27.56
  Bottom 0.305: Q4.G 45.72,13.97 46.99,15.24 46.99,17.78 48.26,19.05 Q3.G 49.66,19.18 v49.66,27.56
GND  (via drill 0.4)
  Top 0.305: IC1.3 90.79,34.3 v91.44,33.66 90.79,33.01 IC1.5 | IC1.12 94.63,34.3 v93.98,33.66 94.63,33.01 IC1.10 | IC3.3 65.39,12.08 v66.04,11.43 65.39,10.78 IC3.5 | IC3.12 69.23,12.08 v68.58,11.43 69.23,10.78 IC3.10 | IC2.12 69.23,32.4 v68.58,31.75 69.23,31.1 IC2.10 | IC4.3 8.24,15.89 v8.89,15.24 8.24,14.59 IC4.5 | IC4.12 12.08,15.89 v11.43,15.24 12.08,14.59 IC4.10 | v91.19,12.19 91.06,12.06 89.83,12.06 IC5.3 | IC5.12 95.59,12.06 94.36,12.06 v94.23,12.19 | IC5.5 92.47,10.78 v92.71,10.54 92.95,10.78 IC5.10 | IC2.3 65.55,32.4 v65.79,32.64 | IC2.5 65.55,31.1 v65.79,30.86 | Q2.5 v4.57,20.95 | Q1.5 v13.46,20.57
  Top 0.61: IC8.2 8.52,27.94 | 8.52,27.94 C5.2 | C16.2 8.7,27.94 8.52,27.94
  other vias: 5.71,9.53 14.61,9.53 3.17,16.26 17.14,14.22 85.47,11.43 99.95,11.43 88.01,28.57 97.41,28.57 84.84,33.78 100.58,33.66 83.82,22.23 104.14,24.13 59.05,11.43 74.42,11.18 61.98,27.81 72.64,27.3 60.07,33.27 73.41,33.27 82.3,27.69 76.2,22.23 58.42,22.23 19.05,29.84 29.21,39.37 10.29,27.69 11.18,27.69
  pour Top (isolate 0.305): 0,0 105,0 105,41.5 0,41.5
  pour Bottom (isolate 0.305): 0,0 105,0 105,41.5 0,41.5
I_ABC_DRY
  Top 0.305: R30.2 91.02,18.07 90.68,18.41 IC7.16
I_ABC_FB
  Top 0.305: R32.2 67.98,16.26 67.98,17.69 68.71,18.41 IC6.1
I_ABC_GAIN
  Top 0.305: R31.2 66.64,16.26 66.64,17.82 66.04,18.41 IC6.16
I_ABC_GEN_DRY
  Top 0.305: IC5.7 88.37,8.04 R23.2 86.78,8.89 83.82,8.89 R14.1 R15.1
I_ABC_GEN_FB
  Top 0.305: IC3.8 70.33,9.37 | 70.33,9.37 71.65,8.04 R58.2 | R18.1 70.06,9.11 70.33,9.37
I_ABC_GEN_GAIN
  Top 0.305: R52.2 62.97,8.04 64.3,9.37 | 64.3,9.37 IC3.7 | R17.1 64.56,9.11 64.3,9.37
I_ABC_GEN_WET
  Top 0.305: R24.1 95.42,9.48 IC5.8 97.05,8.04 R67.2 98.64,8.89 100.84,8.89 101.6,9.65 R12.1 R13.1
I_ABC_WET
  Top 0.305: R29.2 94.4,17.95 94.87,18.41 IC7.1
I_VAC_A
  Top 0.305: LDR1.1 21.59,25.65 19.56,23.62 10.95,23.62 9.23,21.91 Q2.3
I_VAC_B
  Top 0.305: LDR2.1 19.43,18.67 19.43,21.21 19.12,21.52 Q1.3
MIX_CV_IN  (via drill 0.4)
  Top 0.305: X1.12 66.36,36.07 67.18,36.07 67.94,35.31 78.61,35.31 v78.74,35.18 | v78.74,33.4 79.5,32.64 v79.5,21.46 | v79.5,18.04 79.5,10.88 R66.1
  Bottom 0.305: v78.74,35.18 v78.74,33.4 | v79.5,21.46 v79.5,18.04
N$1
  Top 1.016: D2.C 26.93,31.5 SV1.2
  Bottom 1.016: SV1.1 SV1.2
N$2
  Top 0.305: R20.1 97.4,34.95 IC1.13 93.38,34.95 92.71,34.29 92.71,30.27 R22.2 R21.2
N$7
  Top 0.305: RV5.2 96.25,6.35 99.06,6.35 99.69,6.99 R65.1
N$9
  Top 0.305: IC7.15 87.21,19.68 R28.2
N$10
  Top 0.305: IC1.9 98.58,32.35 99.31,31.62 99.31,31.15 R43.1 100.08,30.31 100.08,26.42 97.16,23.5 IC7.5
N$12
  Top 0.305: IC7.2 98.21,19.68 R27.2
N$13
  Top 0.305: IC1.6 86.84,32.35 86.14,31.66 R42.1 85.34,30.31 85.34,26.67 88.52,23.5 IC7.12
N$14
  Top 0.305: R21.1 96.1,31.21 IC1.8 96.98,31.7 R43.2
N$15
  Top 1.27: D1.A 12.7,31.37 SV1.10
  Bottom 1.016: SV1.9 SV1.10
N$18
  Top 0.254: 92.71,6.35 92.71,8.89
  Top 0.305: R65.2 R67.1 97.4,10.13 IC5.9 93.95,10.13 92.71,8.89 | R66.2 82.13,6.77 82.55,6.35 92.71,6.35
N$20
  Top 0.305: R22.1 90.59,30.93 IC1.7 88.44,31.7 R42.2
N$23
  Top 0.305: IC7.3 97.16,20.95 98.42,22.23 R46.2 98.84,22.48 100.5,24.13 R1.2
N$24
  Top 0.305: IC7.4 97.16,22.23 100.97,26.04 R2.2
N$26
  Top 0.305: IC5.13 97.4,12.73 R44.1 R47.2 100.76,13.12 100.94,12.93 | 100.94,12.93 R12.2 | JP1.1 100.94,15.86 100.94,12.93
N$27
  Top 0.305: R24.2 91.44,8.04 91.44,9.91 91.22,10.13 IC5.6 88.02,10.13 R23.1 R16.2
N$28
  Top 0.305: R44.2 97.05,14.82 96.36,14.13 | 96.36,14.13 IC5.14 | R29.1 96.36,14.98 96.36,14.13
N$31
  Top 0.305: R48.2 88.37,14.82 89.06,14.13 | 89.06,14.13 IC5.1 | R30.1 89.06,14.98 89.06,14.13
N$32
  Top 0.305: IC5.2 88.02,12.73 R48.1 87.42,13.12 85.83,14.71 R49.2 | R49.2 84.92,14.82 83.82,13.72 R14.2 | JP2.1 82.77,17.78 R49.2
N$33
  Top 0.305: IC7.14 87.84,20.95 R3.2
N$34
  Top 0.305: IC7.13 88.39,22.23 86.49,24.13 R45.2 R4.2
N$35
  Top 0.305: RV4.2 75.78,6.38 R57.1
N$36
  Top 0.305: IC3.9 71.24,10.13 71.63,9.74 R58.1 73.44,9.74 74.08,9.11 R57.2 72.81,5.71 R59.2
N$37
  Top 0.305: IC6.15 62.87,19.68 61.59,18.41 R26.2
N$38
  Top 0.305: IC6.2 71.75,19.68 73.03,18.41 R25.2
N$39
  Top 0.305: IC2.9 71.47,30.45 72.01,30.99 74.55,30.99 75.14,30.39 R35.1 75.14,29.43 74.3,28.57 71.37,28.57 71.12,28.57 68.58,28.57 68.07,28.07 68.07,24.13 68.71,23.5 IC6.5
N$40
  Top 0.305: IC2.6 63.15,30.45 61.85,31.75 60.2,31.75 59.48,31.03 R64.1 59.48,25.74 59.94,25.27 61.85,25.27 62.36,24.77 62.36,24.26 63.12,23.5 IC6.12
N$41
  Top 0.305: IC2.1 IC2.2
N$42
  Top 0.305: IC2.14 IC2.13
N$43
  Top 0.305: IC6.3 71.75,20.95 72.39,20.32 R37.2 R6.2
N$44
  Top 0.305: R56.1 87.81,34.95 IC1.2 91.09,34.95 91.44,35.31 91.44,36.2 90.04,37.59 84.16,37.59 R55.2
N$45
  Top 0.305: IC6.4 71.37,22.23 73.28,24.13 R5.2
N$46
  Top 0.305: IC6.14 62.87,20.95 62.23,20.32 R7.2
N$48
  Top 0.305: IC6.13 R8.2 R36.2
N$49
  Top 0.305: R60.1 11.2,4.89 RV1.2
N$50
  Top 0.305: R50.1 53.76,4.86 RV3.2
N$51
  Top 0.305: IC3.6 62.62,10.13 R52.1 61.9,9.74 61.05,8.89 R51.2 59.27,8.51 57.11,6.35 R50.2
N$52
  Top 0.305: R17.2 66.93,8.29 66.93,11.81 66.01,12.73 IC3.2 62.62,12.73 R33.1 61.81,13.12 60.96,13.97 R34.2
N$53
  Top 0.305: R33.2 62.97,14.82 63.66,14.13 | 63.66,14.13 IC3.1 | R31.1 63.66,14.98 63.66,14.13
N$54
  Top 0.305: R38.2 71.65,14.82 70.96,14.13 | 70.96,14.13 IC3.14 | R32.1 70.96,14.98 70.96,14.13
N$55
  Top 0.305: R18.2 67.69,8.29 67.69,11.81 68.61,12.73 IC3.13 72,12.73 R38.1 R39.2
N$56
  Top 0.305: IC4.6 5.47,13.94 R62.1 4.88,13.55 R61.2 3.17,10.58 7.41,6.35 R60.2
N$57
  Top 0.305: RV2.2 28.65,6.35 R63.1
N$58
  Top 0.305: IC4.9 14.85,13.94 R53.1 19.05,13.55 R54.2 19.47,11.64 24.77,6.35 R63.2
N$59
  Top 0.305: R9.1 R40.2 9.65,12.61 9.65,20.19 8.89,20.95 Q2.2
N$60
  Top 0.305: Q2.6 6.29,20 7.24,19.05 8.26,19.05 8.76,18.54 8.76,16.89 8.41,16.54 IC4.2 5.67,16.54 C17.1 3.53,17.13 R68.2
N$61
  Top 0.305: IC4.1 6.02,18.43 C17.2 4.88,18.43 R70.1
N$64
  Top 0.305: Q2.1 7.3,20 6.99,20.32 6.99,21.59 6.67,21.91 Q2.4 R70.2
N$67  (via drill 0.4)
  Top 0.305: R10.1 R41.2 10.67,12.61 10.67,21.97 11.43,22.73 v17.65,22.73 | Q1.2 18.29,20.57 v18.41,20.7
  Bottom 0.305: v18.41,20.7 18.41,21.97 v17.65,22.73
N$68
  Top 0.305: R15.2 81.92,14.61 JP2.2
N$69
  Top 0.305: IC4.13 15.2,16.54 C18.1 16.41,16.5 R69.2 16.93,17.74 15.05,19.62 Q1.6
N$70
  Top 0.305: C18.2 14.49,17.8 13.89,17.19 IC4.14 13.06,17.99 R71.1
N$73
  Top 0.305: Q1.1 16.19,19.62 15.88,19.94 15.88,21.21 15.56,21.52 Q1.4 12.7,21.52 R71.2
N$75
  Top 0.305: R11.2 Q4.S
N$77
  Top 0.305: R13.2 103.5,14.61 JP1.2
VAC_A_CV
  Top 0.305: R62.2 5.82,11.85 5.88,11.9 | 5.88,11.9 IC4.7 | R40.1 6.35,11.43 5.88,11.9
VAC_A_CV_IN
  Top 0.254: 9.4,23.24 2.41,23.24 1.91,22.73 1.91,18.92 2.03,18.8 2.03,14.69 R61.1
  Top 0.305: 9.4,23.24 10.54,24.38 18.8,24.38 19.94,25.53 19.94,27.18 20.95,28.19 29.46,28.19 39.03,37.76 X1.2
VAC_B_CV
  Top 0.305: R53.2 14.5,11.85 14.45,11.9 | 14.45,11.9 IC4.8 | R41.1 13.97,11.43 14.45,11.9
VAC_B_CV_IN
  Top 0.305: R54.1 21.34,13.97 22.91,15.55 22.91,17.6 20.32,20.19 20.32,22.86 21.59,24.13 26.67,24.13 38.1,35.56 40.64,35.56 41.57,36.49 X1.3
WET  (via drill 0.4)
  Top 0.305: C21.2 57.53,16.76 60.2,16.76 | v65.66,16.76 60.2,16.76 | v90.17,16.89 85.98,16.89 83.69,19.18 76.33,19.18 | v95.25,16.89 99.19,16.89 101.98,19.68 101.98,21.59 101.35,22.23 R46.1 | R37.1 75.95,20.32 76.33,19.94 76.33,19.18 | 76.33,19.18 76.33,17.4 75.31,16.38 69.34,16.38 v68.96,16.76 | TP4.TP 60.2,16.76
  Bottom 0.305: v65.66,16.76 v68.96,16.76 | v90.17,16.89 v95.25,16.89

### Text on the board
tPlace: pandora B v1.0 | (c) 2022 expert sleepers | -12V